# Altium schematic sheet Torpedo Module Control Connector.SchDoc
size A4
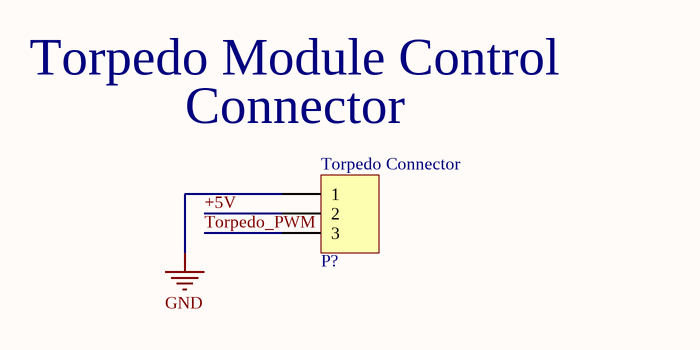
[diagram p0: Torpedo Module Control Connector.SchDoc]

## Parts
P?  HDR1X3  [Molex SPOX Horizontal 3 Circuits]  (value not drawn)

## Nets
GND: P?.1
+5V: P?.2
Torpedo_PWM: P?.3

## Notes on the sheet
- Torpedo Module Control
- (near P?) Connector
- (near P?) Torpedo Connector

## Library data of the parts
P? = HDR1X3: Header, 3-Pin; LatestRevisionDate: 17-Jul-2002; LatestRevisionNote: Re-released for DXP Platform.; Publisher: Altium Limited